# Altium project Buck-boost.PrjPcb
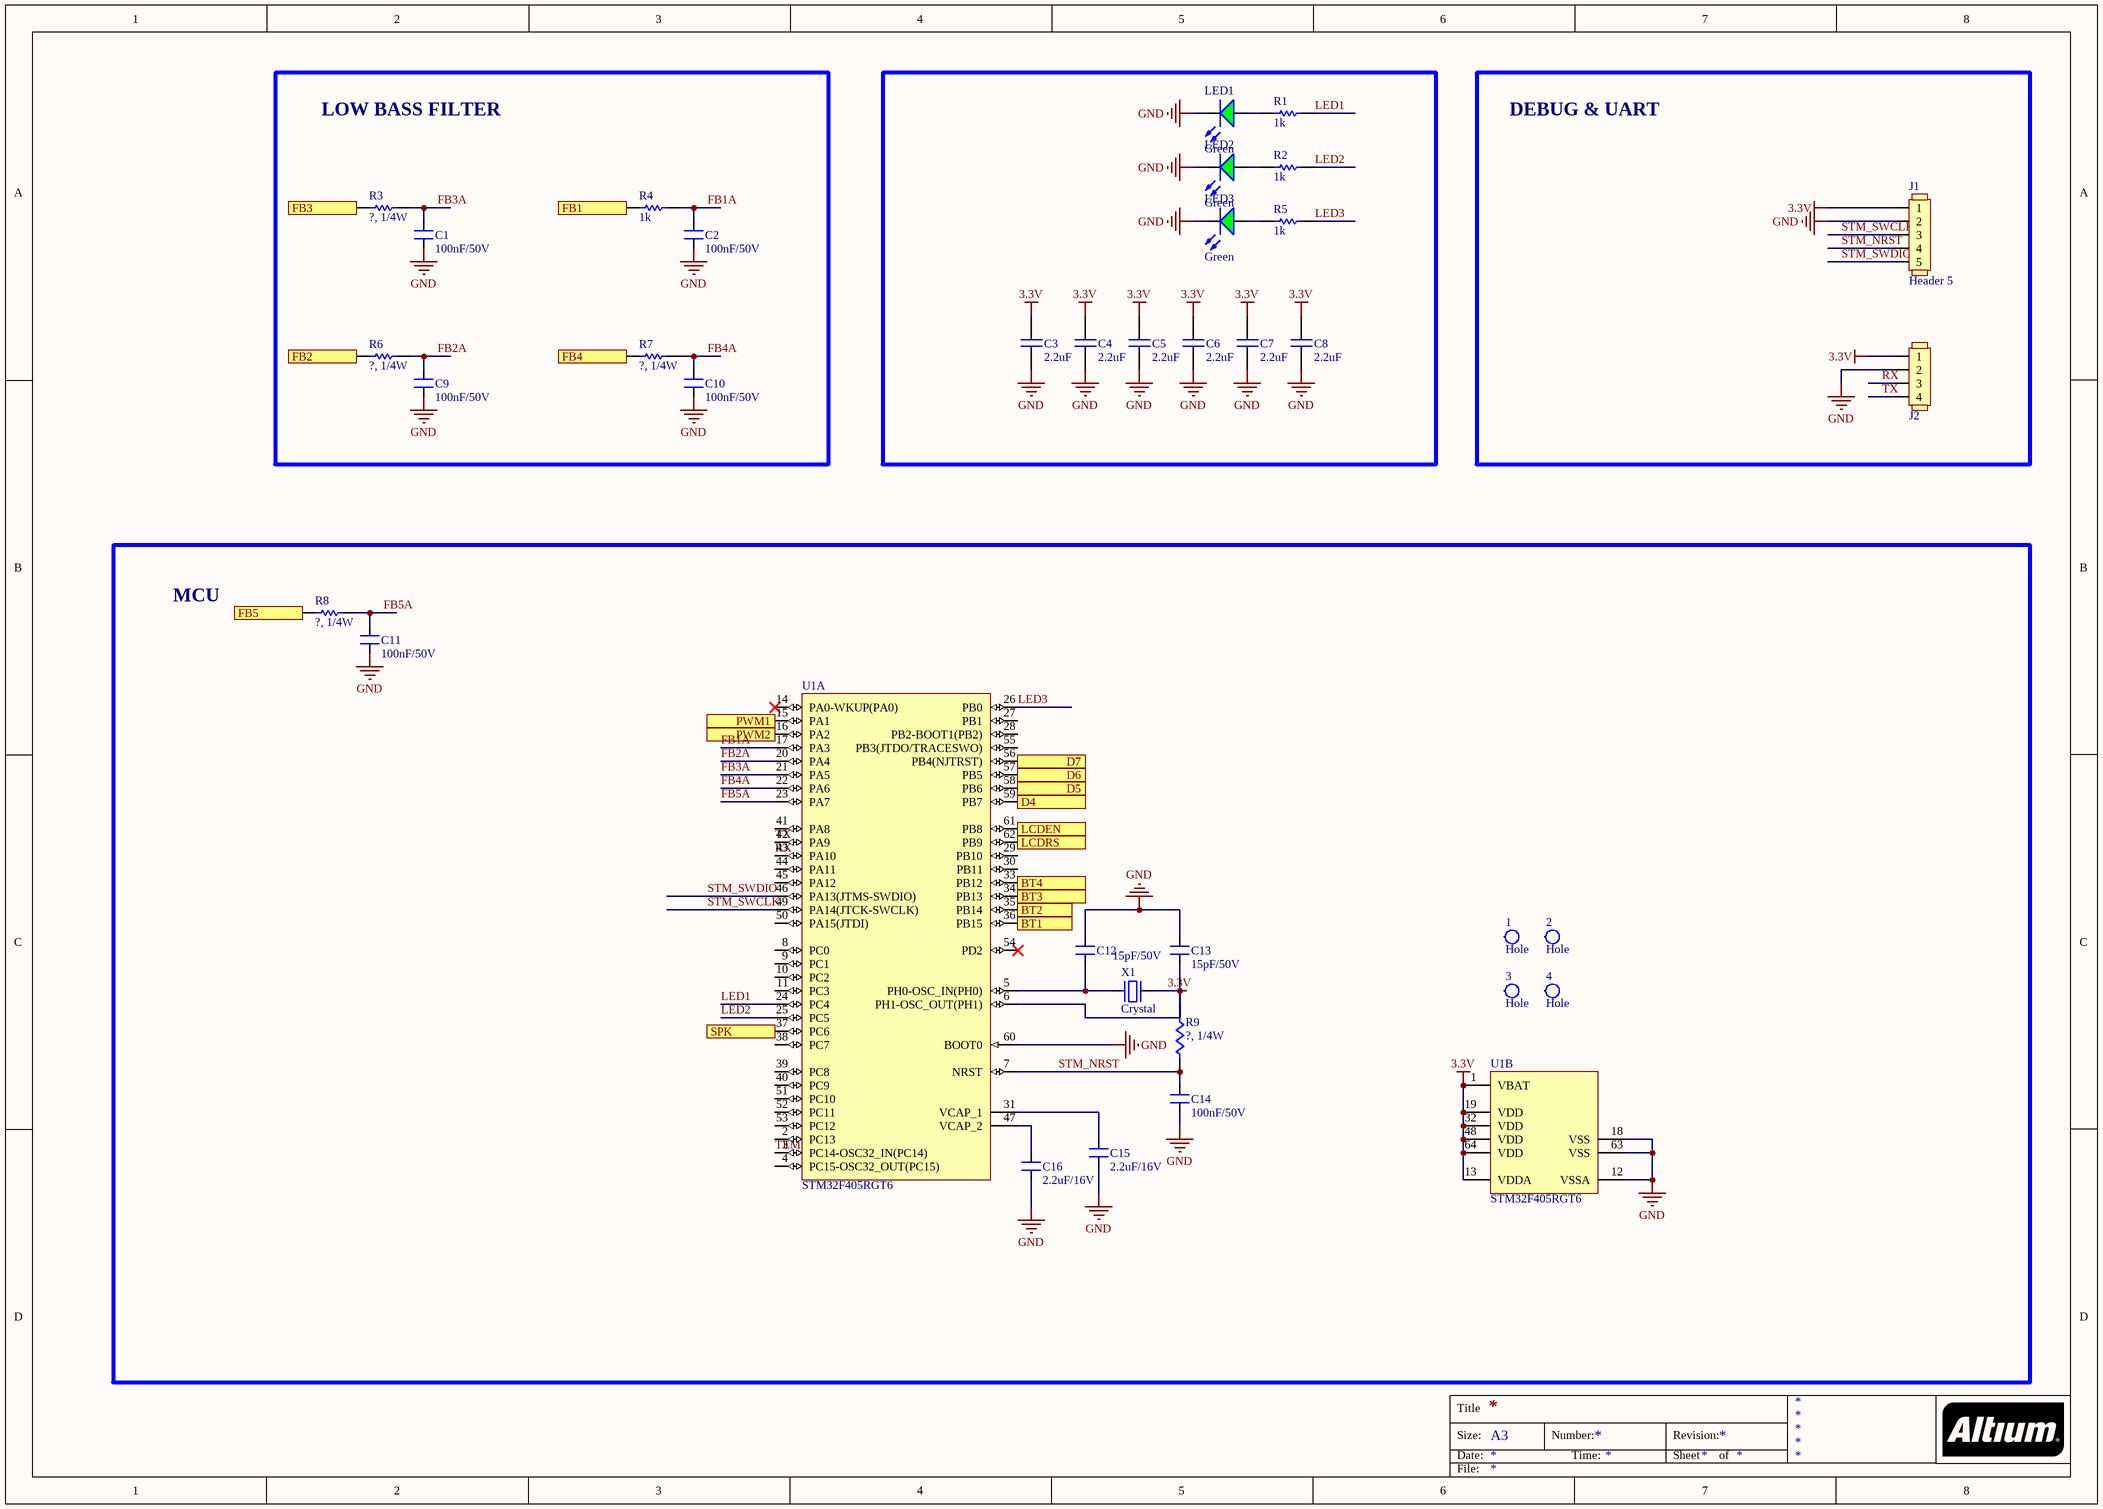
[diagram p0: MCU.SchDoc]
3 sheets, 115 parts. Net scope: flat (ports and power ports of the same name join across sheets).
Board file: Buck-boost v3.1.PcbDoc
Sheets:
  MCU.SchDoc
  MOSFET.SchDoc
  POWER.SchDoc

## Sheet MCU.SchDoc
size A3

### Parts
1  Hole  [Screw 3.0]
2  Hole  [Screw 3.0]
3  Hole  [Screw 3.0]
4  Hole  [Screw 3.0]
C1  100nF/50V  [CAP 0603(1508)]
C2  100nF/50V  [CAP 0603(1508)]
C3  2.2uF  [CAP 0603(1508)]
C4  2.2uF  [CAP 0603(1508)]
C5  2.2uF  [CAP 0603(1508)]
C6  2.2uF  [CAP 0603(1508)]
C7  2.2uF  [CAP 0603(1508)]
C8  2.2uF  [CAP 0603(1508)]
C9  100nF/50V  [CAP 0603(1508)]
C10  100nF/50V  [CAP 0603(1508)]
C11  100nF/50V  [CAP 0603(1508)]
C12  15pF/50V  [CAP 0603(1508)]
C13  15pF/50V  [CAP 0603(1508)]
C14  100nF/50V  [CAP 0603(1508)]
C15  2.2uF/16V  [CAP 0603(1508)]
C16  2.2uF/16V  [CAP 0603(1508)]
J1  Header 5  [HEADER x5]
J2  Header 4  [HEADER x4]  (value not drawn)
LED1  value Green  [LED0805GREEN]  (hidden comment: LED_GREEN)
LED2  value Green  [LED0805GREEN]  (hidden comment: LED_GREEN)
LED3  value Green  [LED0805GREEN]  (hidden comment: LED_GREEN)
R1  1k  [RES 0603(1508)]
R2  1k  [RES 0603(1508)]
R3  ?, 1/4W  [RES 0603(1508)]
R4  1k  [RES 0603(1508)]
R5  1k  [RES 0603(1508)]
R6  ?, 1/4W  [RES 0603(1508)]
R7  ?, 1/4W  [RES 0603(1508)]
R8  ?, 1/4W  [RES 0603(1508)]
R9  ?, 1/4W  [RES 0603(1508)]
U1  STM32F405RGT6  [STM-LQFP64_N]  (parts A,B of 2)
X1  Crystal  [Crystal]

### Blocks framed on the sheet
LOW BASS FILTER: C1 C2 C9 C10 R3 R4 R6 R7
DEBUG & UART: J1 J2
MCU: 1-4 C11-C16 R8 R9 U1 X1

### Ports
BT1, BT2, BT3, BT4, D4, D5, D6, D7, FB1, FB2, FB3, FB4, FB5, LCDEN, LCDRS, PWM1, PWM2, SPK

### Nets
3.3V: C3.2 C4.2 C5.2 C6.2 C7.2 C8.2 C13.1 J1.1 J2.1 R9.2 U1.1(VBAT) U1.6(PH1-OSC_OUT(PH1)) U1.13(VDDA) U1.19(VDD) U1.32(VDD) U1.48(VDD) U1.64(VDD) X1.2
GND: C1.1 C2.1 C3.1 C4.1 C5.1 C6.1 C7.1 C8.1 C9.1 C10.1 C11.1 C12.2 C13.2 C14.1 C15.2 C16.1 J1.2 J2.2 LED1.2(K) LED2.2(K) LED3.2(K) U1.12(VSSA) U1.18(VSS) U1.60(BOOT0) U1.63(VSS)
FB1A: C2.2 R4.1 U1.17(PA3)
FB2A: C9.2 R6.1 U1.20(PA4)
FB3A: C1.2 R3.1 U1.21(PA5)
FB4A: C10.2 R7.1 U1.22(PA6)
FB5A: C11.2 R8.1 U1.23(PA7)
LED1: R1.1 U1.24(PC4)
LED2: R2.1 U1.25(PC5)
LED3: R5.1 U1.26(PB0)
RX: J2.3 U1.43(PA10)
STM_NRST: C14.2 J1.4 R9.1 U1.7(NRST)
STM_SWCLK: J1.3 U1.49(PA14(JTCK-SWCLK))
STM_SWDIO: J1.5 U1.46(PA13(JTMS-SWDIO))
TEM: U1.3(PC14-OSC32_IN(PC14))
TX: J2.4 U1.42(PA9)
NetBT1_2: U1.36(PB15) ; port BT1
NetBT2_2: U1.35(PB14) ; port BT2
NetBT3_2: U1.34(PB13) ; port BT3
NetBT4_2: U1.33(PB12) ; port BT4
NetC12_1: C12.1 U1.5(PH0-OSC_IN(PH0)) X1.1
NetC15_1: C15.1 U1.31(VCAP_1)
NetC16_2: C16.2 U1.47(VCAP_2)
NetIC1_2: U1.15(PA1) ; port PWM1
NetIC1_3: U1.16(PA2) ; port PWM2
NetLCD1_4: U1.62(PB9) ; port LCDRS
NetLCD1_6: U1.61(PB8) ; port LCDEN
NetLCD1_11: U1.59(PB7) ; port D4
NetLCD1_12: U1.58(PB6) ; port D5
NetLCD1_13: U1.57(PB5) ; port D6
NetLCD1_14: U1.56(PB4(NJTRST)) ; port D7
NetLED1_1: LED1.1(A) R1.2
NetLED2_1: LED2.1(A) R2.2
NetLED3_1: LED3.1(A) R5.2
NetOP1_1: R4.2 ; port FB1
NetOP1_7: R6.2 ; port FB2
NetOP2_1: R3.2 ; port FB3
NetOP2_6: R7.2 ; port FB4
NetOP3_1: R8.2 ; port FB5
NetR31_1: U1.37(PC6) ; port SPK

Not connected (* = marked no-connect by the designer): 1 1; 2 1; 3 1; 4 1; U1 2(PC13) 4(PC15-OSC32_OUT(PC15)) 8(PC0) 9(PC1) 10(PC2) 11(PC3) 14(PA0-WKUP(PA0))* 27(PB1) 28(PB2-BOOT1(PB2)) 29(PB10) 30(PB11) 38(PC7) 39(PC8) 40(PC9) 41(PA8) 44(PA11) 45(PA12) 50(PA15(JTDI)) 51(PC10) 52(PC11) 53(PC12) 54(PD2)* 55(PB3(JTDO/TRACESWO))

### Notes on the sheet
- Title
- Size:
- Date:
- A3
- Number:
- Time:
- Revision:
- Sheet
- of
- File:

### Library data of the parts
C1 C2 C9-C11 C14 = CAP_CER_100nF_50V_NPOL: Ceramic Capacitor 100nF/50V (+-20% TH)/(+10%SMD)
C3-C8 = Cap2: Non_Polarized Capacitor
C12 C13 = CAP_CER_15pF_50V_NPOL: Ceramic Capacitor 15pF/50V (+-10% TH)/(+5%SMD)
C15 C16 = CAP_CER_2.2uF_16V_NPOL: Ceramic Capacitor 2.2uF/16V (+-10% TH)/(+10%SMD)
LED1-LED3 = LED_GREEN: LED Green; ComponentLink1Description: Datasheet; ComponentLink1URL: D:\Dropbox\Datasheets\Opto and Illumination\LEDs\SMD LED.pdf; Unit Price: 0.0476
R1-R9 = Resistor 1/4W: Resistor through hole 1/4W
U1 = STM32F405RGT6: ARM Cortex-M4 32-bit MCU+FPU, 210 DMIPS, 1024 kB Flash, 192 kB Internal RAM, 51 I/Os, 64-pin LQFP, -40 to 85 degC, Tray; Manufacturer: STMicroelectronics; D/A Converter: 2x12-bit; FLASH Size (Prog) (kB): 1024; I/Os (High Current): 51; Internal RAM Size (kB): 192; Operating Frequency(F) (Processor speed) (MHz): 168; Supply Voltage(Vcc) max (V): 3.6; Supply Voltage(Vcc) min (V): 1.8; DatasheetVersion: Rev. 4; PackageVersion: Rev. 4, 06/2013; PackageReference: LQFP64; PackageDescription: 64-Pin Low Profile Quad Flat Package, 10 x 10 mm Body, 0.5 mm Pitch; Supplier 1: Digi-Key; Supplier Part Number 1: 497-11767-ND; Supplier 2: Farnell; Supplier Part Number 2: 2064363; Supplier 3: Newark; Supplier Part Number 3: 73T2329; Supplier 4: Mouser; Supplier Part Number 4: 511-STM32F405RGT6; Core: ARM Cortex-M4; Packing: Tray; Mounting Technology: Surface Mount; PartNumber: STM32F405RGT6; ComponentLink1Description: Manufacturer URL; ComponentLink1URL: http://www.st.com/web/en/home.html; ComponentLink2Description: Datasheet; ComponentLink2URL: http://www.st.com/st-web-ui/static/active/en/resource/technical/document/datasheet/DM00037051.pdf; ComponentLink3Description: Package Specification; ComponentLink3URL: http://www.st.com/st-web-ui/static/active/en/resource/technical/document/datasheet/DM00037051.pdf
X1 = Crystal: Crystal through hole

## Sheet MOSFET.SchDoc
size A4
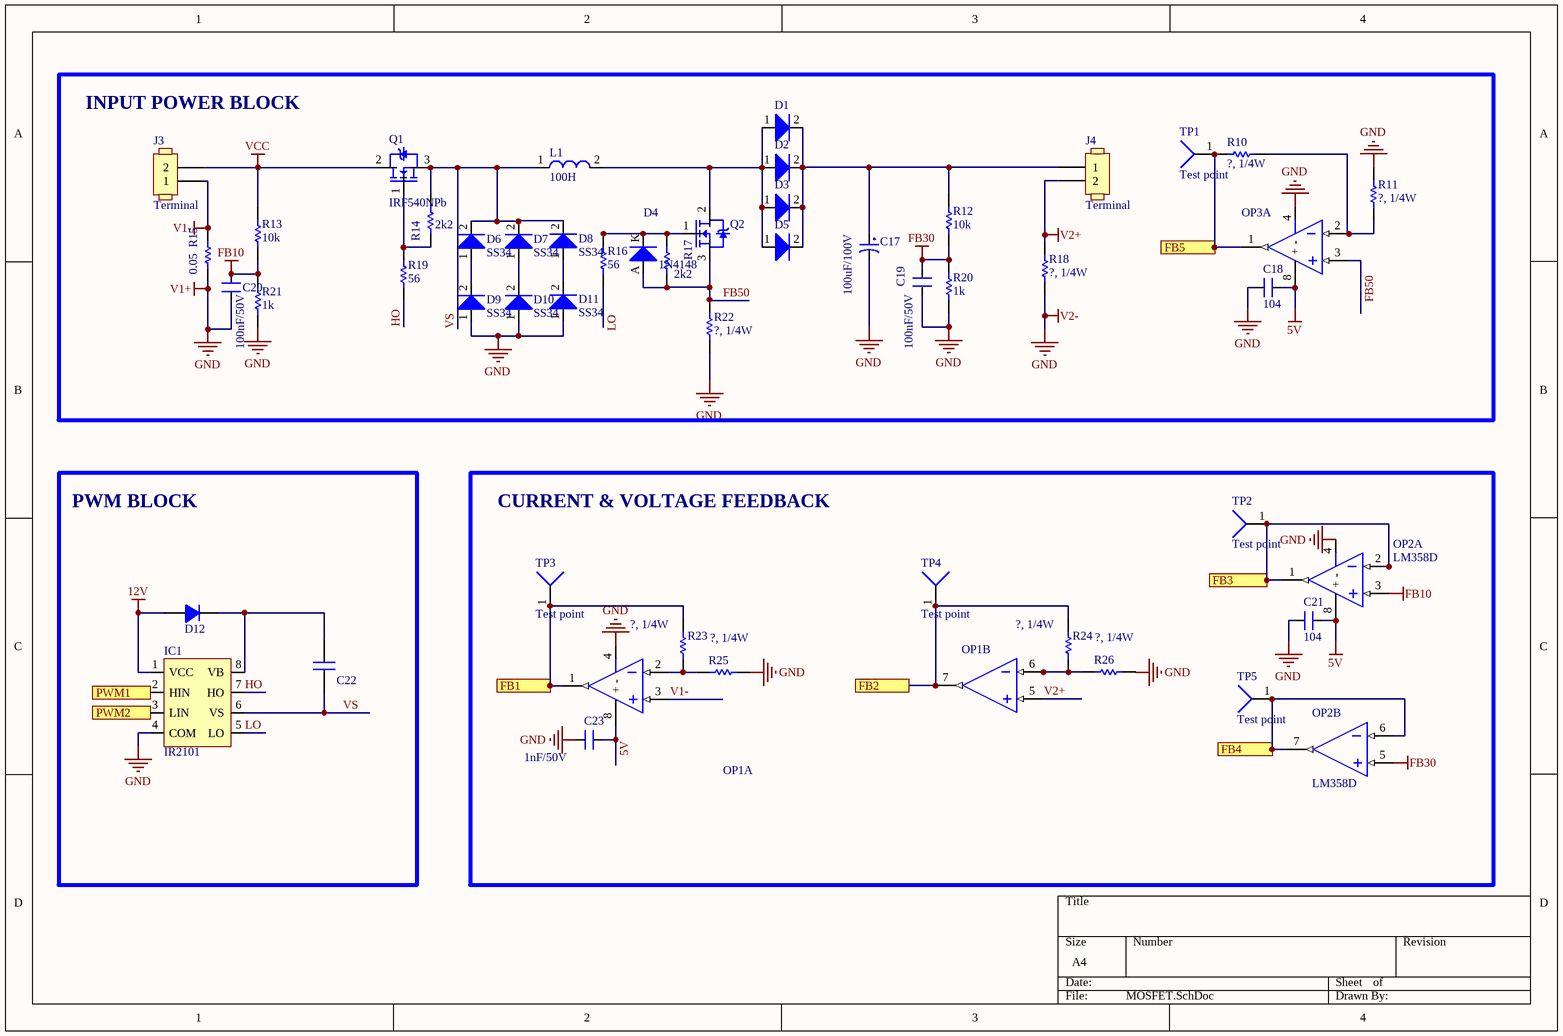
[diagram p1: MOSFET.SchDoc]

### Parts
C17  100uF/100V  [CAP_xUF_50V_TH_10x16 HORIZONTAL]
C18  104  [CAP 0603(1508)]
C19  100nF/50V  [CAP 0603(1508)]
C20  100nF/50V  [CAP 0603(1508)]
C21  104  [CAP 0603(1508)]
C22  C1210  [CAPACITOR-SMD-1210 (3225)]  (value not drawn)
C23  1nF/50V  [CAP 0603(1508)]
D1  UF4007  [DO204SMDDUAL]  (value not drawn)
D2  UF4007  [DO204SMDDUAL]  (value not drawn)
D3  UF4007  [DO204SMDDUAL]  (value not drawn)
D4  1N4148  [LL34]
D5  UF4007  [DO204SMDDUAL]  (value not drawn)
D6  SS34  [SS34]
D7  SS34  [SS34]
D8  SS34  [SS34]
D9  SS34  [SS34]
D10  SS34  [SS34]
D11  SS34  [SS34]
D12  UF4007  [DO-41-10mm]  (value not drawn)
IC1  IR2101  [IR2101]
J3  Terminal  [Terminal x2 5mm]
J4  Terminal  [Terminal x2 5mm]
L1  100H  [INDUCTOR 5A LIE]
OP1  LM358D  [SOIC8_600]  (value not drawn)  (parts A,B of 2)
OP2  LM358D  [SOIC8_600]  (parts A,B of 2)
OP3  LM358D  [SOIC8_600]  (value not drawn)  (part A of 2)
Q1  IRF540NPb  [IRF540NPBF HORIZONTAL]
Q2  IRF540NPb  [IRF540NPBF HORIZONTAL]  (value not drawn)
R10  ?, 1/4W  [RES 0603(1508)]
R11  ?, 1/4W  [RES 0603(1508)]
R12  10k  [RES 0603(1508)]
R13  10k  [RES 0603(1508)]
R14  2k2  [RES 0603(1508)]
R15  0.05  [RES 2512(6332)]
R16  56  [RES 0603(1508)]
R17  2k2  [RES 0603(1508)]
R18  ?, 1/4W  [RES 2512(6332)]
R19  56  [RES 0603(1508)]
R20  1k  [RES 0603(1508)]
R21  1k  [RES 0603(1508)]
R22  ?, 1/4W  [RES 2512(6332)]
R23  ?, 1/4W  [RES 0603(1508)]
R24  ?, 1/4W  [RES 0603(1508)]
R25  ?, 1/4W  [RES 0603(1508)]
R26  ?, 1/4W  [RES 0603(1508)]
TP1  Test point  [Test_point_VIA06]
TP2  Test point  [Test_point_VIA06]
TP3  Test point  [Test_point_VIA06]
TP4  Test point  [Test_point_VIA06]
TP5  Test point  [Test_point_VIA06]

### Blocks framed on the sheet
INPUT POWER BLOCK: C17-C20 D1-D11 J3 J4 L1 OP3 Q1 Q2 R10-R22 TP1
PWM BLOCK: C22 D12 IC1
CURRENT & VOLTAGE FEEDBACK: C21 C23 OP1 OP2 R23-R26 TP2-TP5

### Ports
FB1, FB2, FB3, FB4, FB5, PWM1, PWM2

### Nets
5V: C18.1 C21.1 C23.1 OP1.8(+) OP2.8(+) OP3.8(+)
12V: D12.1(A) IC1.1(VCC)
FB10: C20.2 OP2.3(IN+) R13.2 R21.1
FB30: C19.2 OP2.5(IN+) R12.2 R20.1
GND: C17.2 C18.2 C19.1 C20.1 C21.2 C23.2 D9.1(A) D10.1(A) D11.1(A) IC1.4(COM) OP1.4(-) OP2.4(-) OP3.4(-) R11.1 R15.2 R18.1 R20.2 R21.2 R22.2 R25.1 R26.1  [also labelled V1+, V2-]
V1-: J3.1 OP1.3(IN+) R15.1
V2+: J4.2 OP1.5(IN+) R18.2
VCC: J3.2 Q1.2(D) R13.1
FB50: D4.A OP3.3(IN+) Q2.3(S) R17.2 R22.1
HO: IC1.7(HO) R19.2
LO: IC1.5(LO) R16.2
VS: C22.1 D6.2(K) D7.2(K) D8.2(K) IC1.6(VS) L1.1 Q1.3(S) R14.1
NetC17_1: C17.1 D1.2(K) D2.2(K) D3.2(K) D5.2(K) J4.1 R12.1
NetC22_2: C22.2 D12.2(K) IC1.8(VB)
NetD1_1: D1.1(A) D2.1(A) D3.1(A) D5.1(A) L1.2 Q2.2(D)
NetD4_K: D4.K Q2.1 R16.1 R17.1
NetD6_1: D6.1(A) D9.2(K)
NetD7_1: D7.1(A) D10.2(K)
NetD8_1: D8.1(A) D11.2(K)
NetIC1_2: IC1.2(HIN) ; port PWM1
NetIC1_3: IC1.3(LIN) ; port PWM2
NetOP1_1: OP1.1(OUT) R23.1 TP3.1 ; port FB1
NetOP1_2: OP1.2(IN-) R23.2 R25.2
NetOP1_6: OP1.6(IN-) R24.2 R26.2
NetOP1_7: OP1.7(OUT2) R24.1 TP4.1 ; port FB2
NetOP2_1: OP2.1(OUT) OP2.2(IN-) TP2.1 ; port FB3
NetOP2_6: OP2.6(IN-) OP2.7(OUT2) TP5.1 ; port FB4
NetOP3_1: OP3.1(OUT) R10.2 TP1.1 ; port FB5
NetOP3_2: OP3.2(IN-) R10.1 R11.2
NetQ1_1: Q1.1 R14.2 R19.1

### Library data of the parts
C17 = CAP_ALU/CHE_100uF_100V_POL_10x16
C18 C21 C23 = CAP_CER_1nF_50V_NPOL: Ceramic Capacitor 1nF/50V (+-20% TH)/(+10%SMD)
C19 C20 = CAP_CER_100nF_50V_NPOL: as C1 on sheet MCU
C22 = C1210: Tụ dán không phân cực 1210
D12 = Diode 1000V 1A
J3 J4 = Terminal x2
L1 = Inductor
R10-R26 = Resistor 1/4W: Resistor through hole 1/4W

## Sheet POWER.SchDoc
size A4
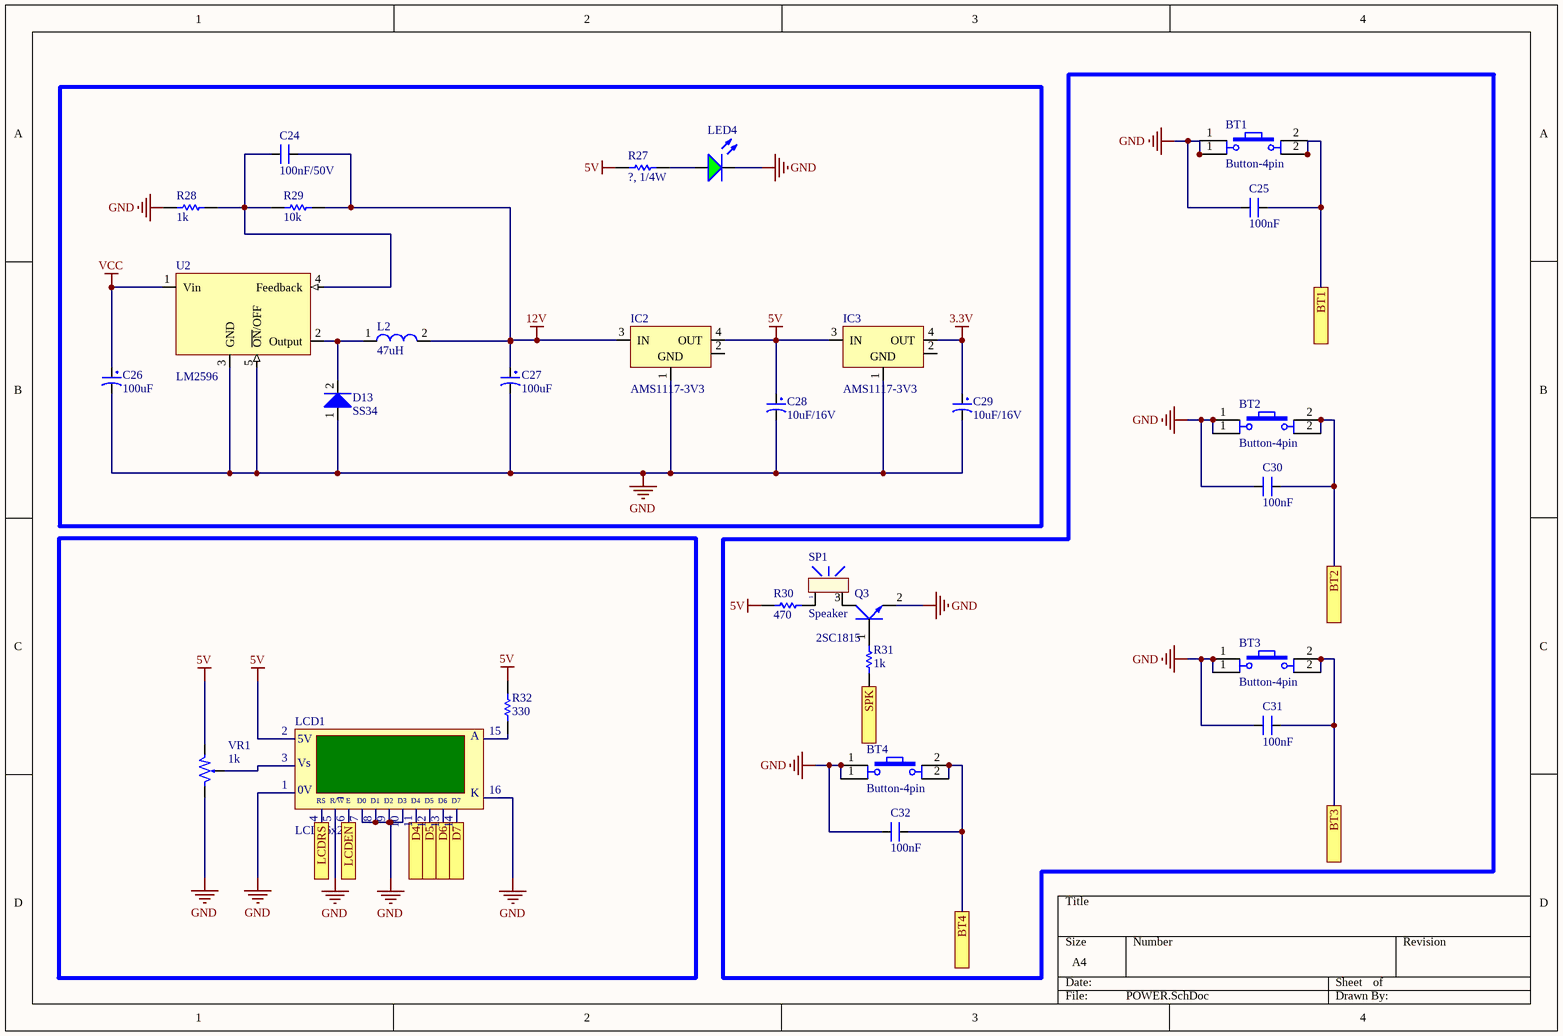
[diagram p2: POWER.SchDoc]

### Parts
BT1  Button-4pin  [Button 12x12x7.3mm]
BT2  Button-4pin  [Button 12x12x7.3mm]
BT3  Button-4pin  [Button 12x12x7.3mm]
BT4  Button-4pin  [Button 12x12x7.3mm]
C24  100nF/50V  [RES 0603(1508)]
C25  100nF  [CAP 0603(1508)]
C26  100uF  [CAP_ALU_SIZED8]
C27  100uF  [CAP_ALU_SIZED8]
C28  10uF/16V  [CAP_TAN_1206(3216)]
C29  10uF/16V  [CAP_TAN_1206(3216)]
C30  100nF  [CAP 0603(1508)]
C31  100nF  [CAP 0603(1508)]
C32  100nF  [CAP 0603(1508)]
D13  SS34  [SS34]
IC2  AMS1117-3V3  [AMS1117]
IC3  AMS1117-3V3  [AMS1117]
L2  47uH  [Inductor SMD 48x48x28mm]
LCD1  LCD16x2  [LCD16x2]
LED4  LED_GREEN  [LED0805GREEN]  (value not drawn)
Q3  2SC1815  [2SC1815-SMD]
R27  ?, 1/4W  [RES 0603(1508)]
R28  1k  [RES 0603(1508)]
R29  10k  [RES 0603(1508)]
R30  470  [RES 0603(1508)]
R31  1k  [RES 0603(1508)]
R32  330  [RES 0603(1508)]
SP1  Speaker  [Speaker]
U2  LM2596  [LM2596]
VR1  1k  [Trimmer 3262]

### Ports
BT1, BT2, BT3, BT4, D4, D5, D6, D7, LCDEN, LCDRS, SPK

### Nets
3.3V: C29.1 IC3.4(OUT)
5V: C28.1 IC2.4(OUT) IC3.3(IN) LCD1.2 R27.2 R30.1 R32.1 VR1.1
12V: C24.2 C27.1 IC2.3(IN) L2.2 R29.1
GND: BT1.1 BT2.1 BT3.1 BT4.1 C25.2 C26.2 C27.2 C28.2 C29.2 C30.2 C31.2 C32.2 D13.1(A) IC2.1(GND) IC3.1(GND) LCD1.1 LCD1.5 LCD1.7 LCD1.8 LCD1.9 LCD1.10 LCD1.16 LED4.2(K) Q3.2(E) R28.2 U2.3(GND) U2.5(~{ON}/OFF) VR1.3
VCC: C26.1 U2.1(Vin)
NetBT1_2: BT1.2 C25.1 ; port BT1
NetBT2_2: BT2.2 C30.1 ; port BT2
NetBT3_2: BT3.2 C31.1 ; port BT3
NetBT4_2: BT4.2 C32.1 ; port BT4
NetC24_1: C24.1 R28.1 R29.2 U2.4(Feedback)
NetD13_2: D13.2(K) L2.1 U2.2(Output)
NetLCD1_3: LCD1.3 VR1.2
NetLCD1_4: LCD1.4 ; port LCDRS
NetLCD1_6: LCD1.6 ; port LCDEN
NetLCD1_11: LCD1.11 ; port D4
NetLCD1_12: LCD1.12 ; port D5
NetLCD1_13: LCD1.13 ; port D6
NetLCD1_14: LCD1.14 ; port D7
NetLCD1_15: LCD1.15(VCC) R32.2
NetLED4_1: LED4.1(A) R27.1
NetQ3_1: Q3.1(B) R31.2
NetQ3_3: Q3.3(C) SP1.2
NetR30_2: R30.2 SP1.1
NetR31_1: R31.1 ; port SPK

Not connected (* = marked no-connect by the designer): IC2 2(OUT); IC3 2(OUT)

### Notes on the sheet
- (in symbol LCD16x2) A; 5V; Vs; 0V; K; RS; R/W; E; D0; D1; D2; D3; D4; D5; D6; D7

### Library data of the parts
C24 = CAP_CER_100nF_50V_NPOL: as C1 on sheet MCU
C25 C30-C32 = CAP_CER_1nF_50V_NPOL: as C18 on sheet MOSFET
C26 C27 = CAP_ALU_100uF_35V_POL_SMD: Aluminum Capacitor 100uF size D
C28 C29 = CAP_TANTA_10uF_16V_POL: Tantalum SMD capacitor 10uF(+-10%),TAJA106K010RNJ
IC2 IC3 = AMS1117-3V3: Linear Voltage Regulator 3.3V 1A 15V Max SOT-223; ComponentLink1Description: Datasheet; ComponentLink1URL: D:\Dropbox\Datasheets\Power Management ICs\Linear Regulators\AMS1117.pdf; Unit Price: 0.2000
L2 = Inductor
LED4 = LED_GREEN: LED Green; ComponentLink1Description: Datasheet; ComponentLink1URL: D:\Dropbox\Datasheets\Opto and Illumination\LEDs\SMD LED.pdf; Unit Price: 0.0476
Q3 = 2SC1815: NPN
R27-R32 = Resistor 1/4W: Resistor through hole 1/4W
SP1 = Speaker: Buzzer through hole (3V3/5V/12V)
U2 = LM2596: Step-Down Switching Regulator 5V 3.0 A 15 V Max
VR1 = Variable Resistor: WH148

## Nets that join several sheets
3.3V: MCU (18 pins), POWER (C29.1 IC3.4)
5V: MOSFET (6 pins), POWER (8 pins)
12V: MOSFET (D12.1 IC1.1), POWER (5 pins)
GND: MCU (25 pins), MOSFET (21 pins), POWER (28 pins)
VCC: MOSFET (J3.2 Q1.2 R13.1), POWER (C26.1 U2.1)
NetBT1_2: MCU (U1.36), POWER (BT1.2 C25.1)
NetBT2_2: MCU (U1.35), POWER (BT2.2 C30.1)
NetBT3_2: MCU (U1.34), POWER (BT3.2 C31.1)
NetBT4_2: MCU (U1.33), POWER (BT4.2 C32.1)
NetIC1_2: MCU (U1.15), MOSFET (IC1.2)
NetIC1_3: MCU (U1.16), MOSFET (IC1.3)
NetLCD1_4: MCU (U1.62), POWER (LCD1.4)
NetLCD1_6: MCU (U1.61), POWER (LCD1.6)
NetLCD1_11: MCU (U1.59), POWER (LCD1.11)
NetLCD1_12: MCU (U1.58), POWER (LCD1.12)
NetLCD1_13: MCU (U1.57), POWER (LCD1.13)
NetLCD1_14: MCU (U1.56), POWER (LCD1.14)
NetOP1_1: MCU (R4.2), MOSFET (OP1.1 R23.1 TP3.1)
NetOP1_7: MCU (R6.2), MOSFET (OP1.7 R24.1 TP4.1)
NetOP2_1: MCU (R3.2), MOSFET (OP2.1 OP2.2 TP2.1)
NetOP2_6: MCU (R7.2), MOSFET (OP2.6 OP2.7 TP5.1)
NetOP3_1: MCU (R8.2), MOSFET (OP3.1 R10.2 TP1.1)
NetR31_1: MCU (U1.37), POWER (R31.1)